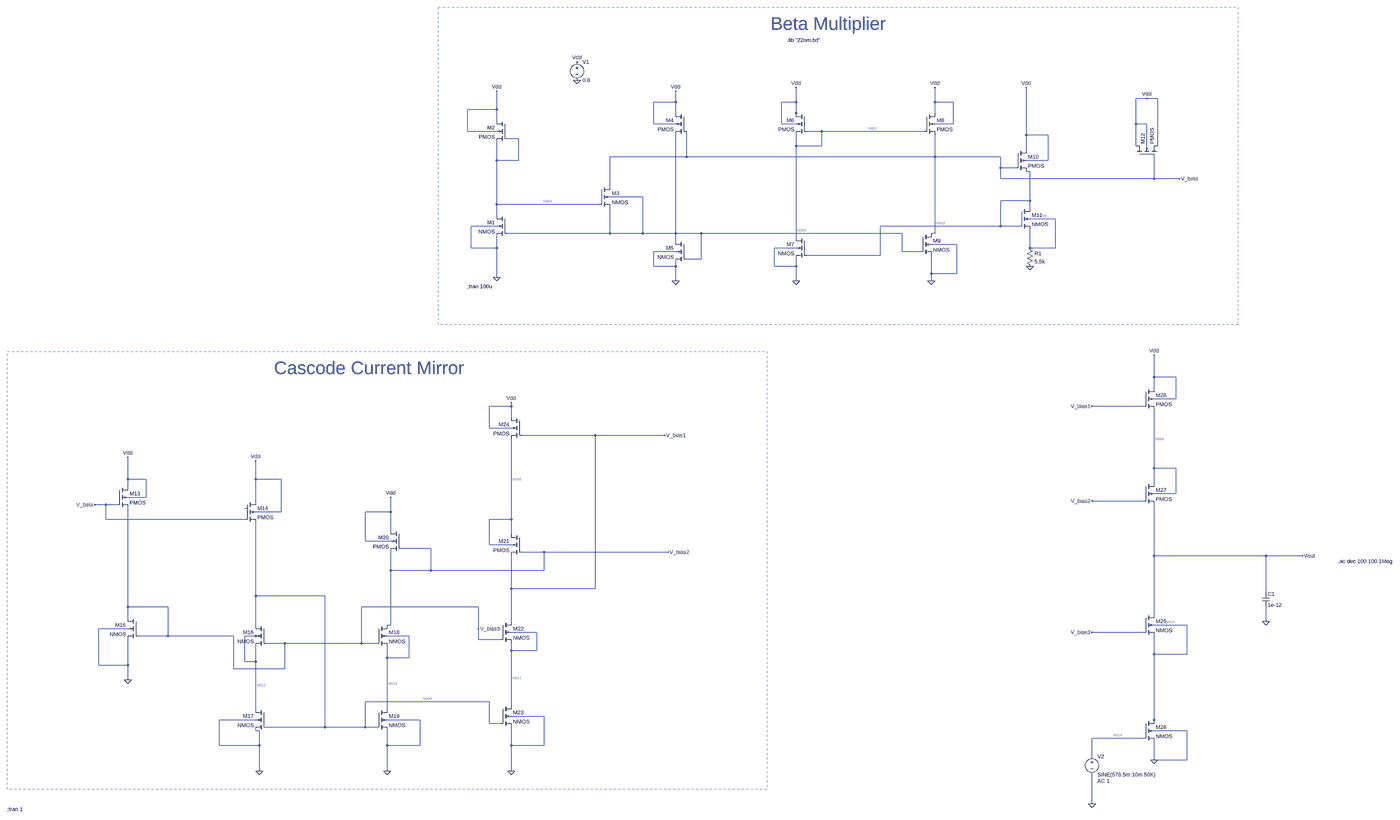
[diagram p0: schematic Vivek_22nm.asc, whole sheet]
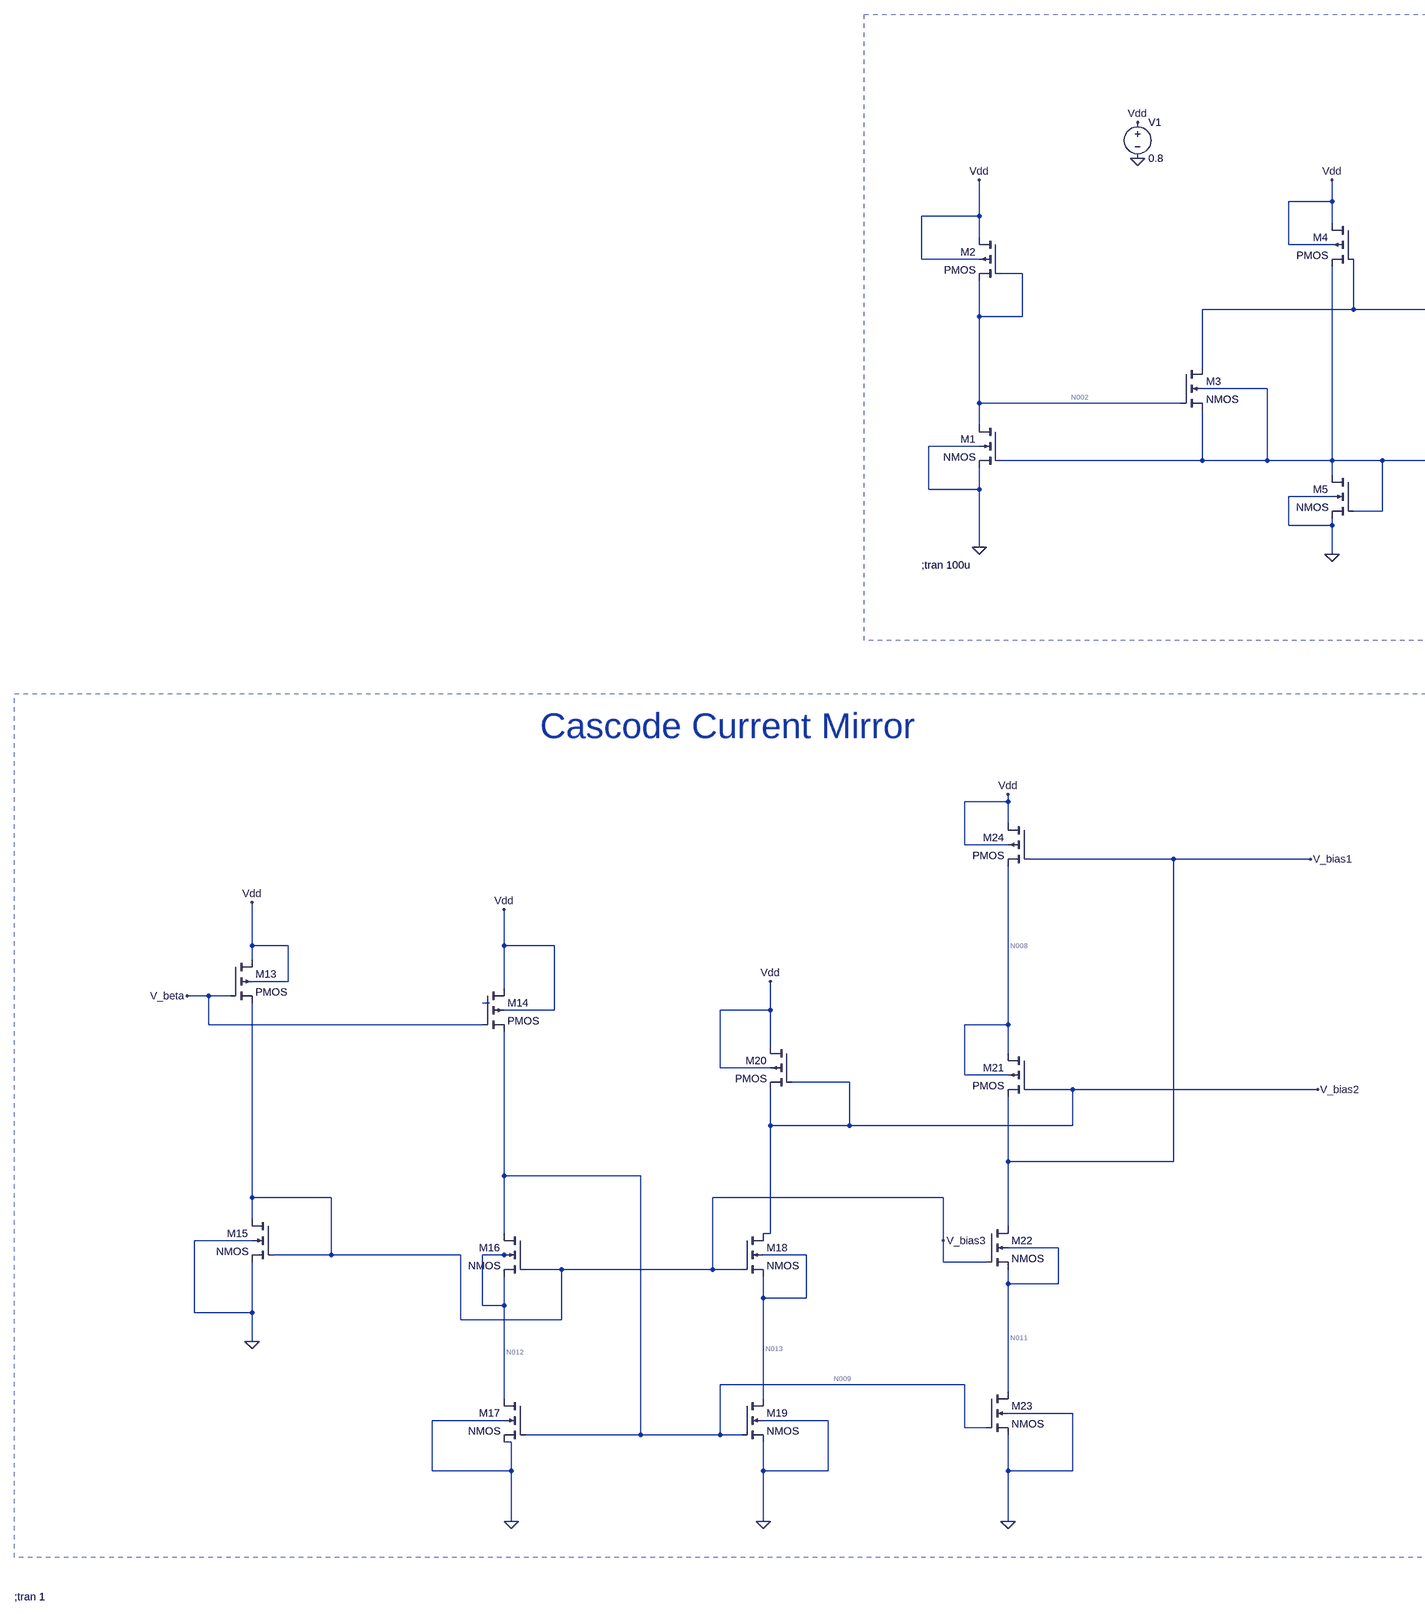
[diagram p1: schematic Vivek_22nm.asc, part, row 1 of 1, column 1 of 2]
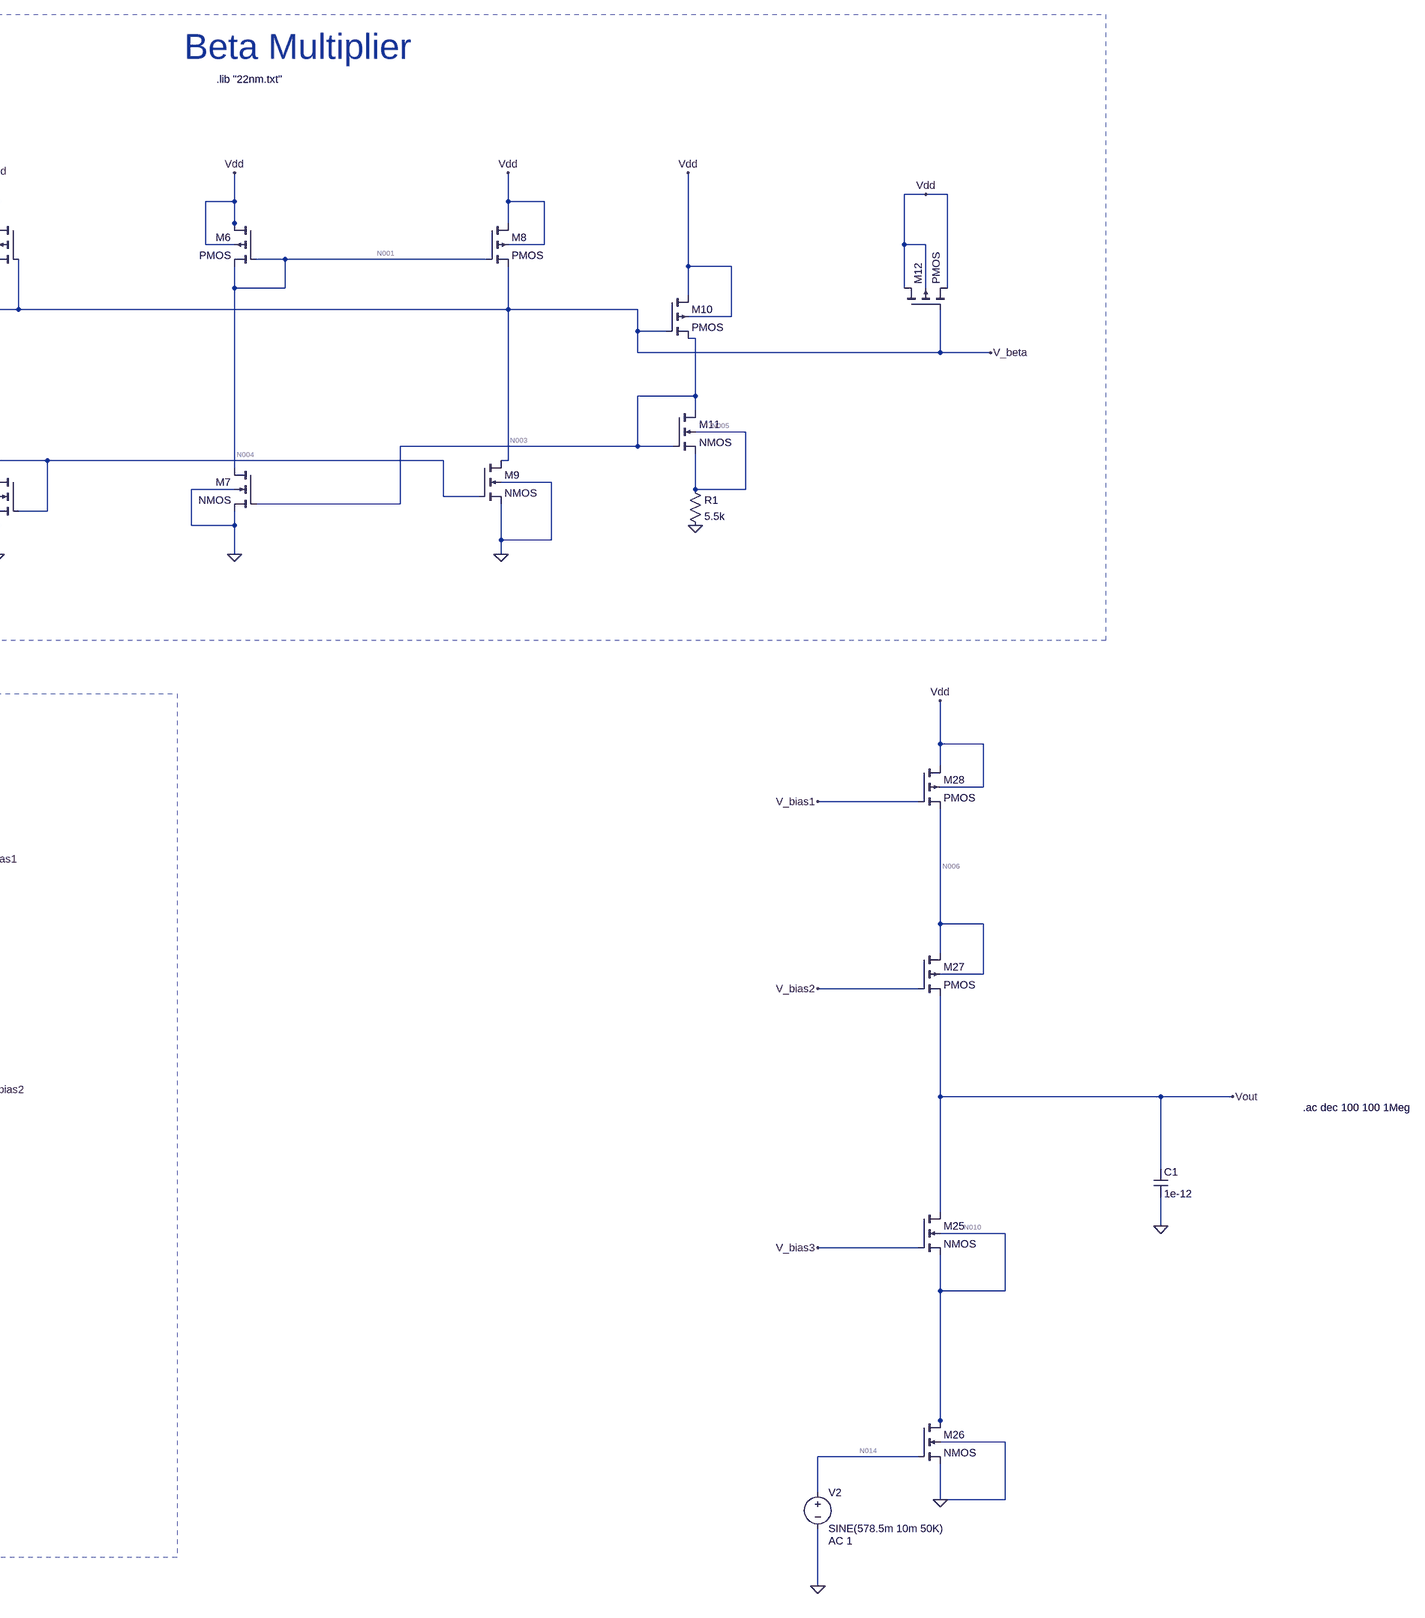
[diagram p2: schematic Vivek_22nm.asc, part, row 1 of 1, column 2 of 2]
Vivek_22nm.asc, the LTspice schematic file:
Version 4
SHEET 1 3448 2104
WIRE 1824 -1168 1776 -1168
WIRE 1872 -1168 1824 -1168
WIRE -240 -1152 -240 -1200
WIRE -240 -1152 -336 -1152
WIRE 288 -1152 288 -1216
WIRE 288 -1152 224 -1152
WIRE 896 -1152 896 -1216
WIRE 976 -1152 896 -1152
WIRE -1024 -1120 -1024 -1200
WIRE -1024 -1120 -1152 -1120
WIRE -240 -1104 -240 -1152
WIRE 288 -1104 288 -1152
WIRE 896 -1104 896 -1152
WIRE 288 -1088 288 -1104
WIRE -1024 -1072 -1024 -1120
WIRE -336 -1056 -336 -1152
WIRE -240 -1056 -336 -1056
WIRE 224 -1056 224 -1152
WIRE 288 -1056 224 -1056
WIRE 976 -1056 976 -1152
WIRE 976 -1056 896 -1056
WIRE 1776 -1056 1776 -1168
WIRE 1824 -1056 1776 -1056
WIRE -1152 -1024 -1152 -1120
WIRE -1024 -1024 -1152 -1024
WIRE 400 -1024 336 -1024
WIRE 848 -1024 400 -1024
WIRE 1296 -1008 1296 -1216
WIRE 1392 -1008 1296 -1008
WIRE -928 -992 -976 -992
WIRE 288 -960 288 -1008
WIRE 400 -960 400 -1024
WIRE 400 -960 288 -960
WIRE 1776 -960 1776 -1056
WIRE 1824 -960 1824 -1056
WIRE 1872 -960 1872 -1168
WIRE 1296 -944 1296 -1008
WIRE -192 -912 -192 -1024
WIRE -192 -912 -528 -912
WIRE 896 -912 896 -1008
WIRE 896 -912 -192 -912
WIRE 1184 -912 896 -912
WIRE -1024 -896 -1024 -976
WIRE -928 -896 -928 -992
WIRE -928 -896 -1024 -896
WIRE 1392 -896 1392 -1008
WIRE 1392 -896 1296 -896
WIRE 1184 -864 1184 -912
WIRE 1248 -864 1184 -864
WIRE 1312 -848 1296 -848
WIRE 1184 -816 1184 -864
WIRE 1856 -816 1856 -912
WIRE 1856 -816 1184 -816
WIRE 1968 -816 1856 -816
WIRE -528 -784 -528 -912
WIRE -384 -736 -528 -736
WIRE 1312 -720 1312 -848
WIRE 1312 -720 1184 -720
WIRE -1024 -704 -1024 -896
WIRE -576 -704 -1024 -704
WIRE 1312 -688 1312 -720
WIRE -1024 -656 -1024 -704
WIRE 1424 -640 1312 -640
WIRE -1024 -608 -1136 -608
WIRE 1184 -608 1184 -720
WIRE 1184 -608 656 -608
WIRE 1264 -608 1184 -608
WIRE -528 -576 -528 -688
WIRE -528 -576 -976 -576
WIRE -384 -576 -384 -736
WIRE -384 -576 -528 -576
WIRE -240 -576 -240 -1008
WIRE -240 -576 -384 -576
WIRE -128 -576 -240 -576
WIRE 752 -576 -128 -576
WIRE 896 -576 896 -912
WIRE 896 -576 880 -576
WIRE 288 -560 288 -960
WIRE -240 -544 -240 -576
WIRE 992 -528 880 -528
WIRE -1136 -512 -1136 -608
WIRE -1024 -512 -1024 -560
WIRE -1024 -512 -1136 -512
WIRE 288 -512 192 -512
WIRE 1312 -512 1312 -592
WIRE 1424 -512 1424 -640
WIRE 1424 -512 1312 -512
WIRE -240 -496 -336 -496
WIRE 752 -496 752 -576
WIRE 832 -496 752 -496
WIRE 656 -480 656 -608
WIRE 656 -480 336 -480
WIRE -128 -464 -128 -576
WIRE -128 -464 -192 -464
WIRE -336 -432 -336 -496
WIRE -240 -432 -240 -448
WIRE -240 -432 -336 -432
WIRE 192 -432 192 -512
WIRE 288 -432 288 -464
WIRE 288 -432 192 -432
WIRE 880 -400 880 -480
WIRE 992 -400 992 -528
WIRE 992 -400 880 -400
WIRE -1024 -384 -1024 -512
WIRE -240 -368 -240 -432
WIRE 288 -368 288 -432
WIRE 880 -368 880 -400
WIRE 1856 192 1856 96
WIRE 1952 192 1856 192
WIRE 1856 240 1856 192
WIRE 1952 288 1952 192
WIRE 1952 288 1856 288
WIRE -960 320 -960 304
WIRE -960 320 -1056 320
WIRE 1808 320 1584 320
WIRE -960 368 -960 320
WIRE -1056 416 -1056 320
WIRE -960 416 -1056 416
WIRE -592 448 -912 448
WIRE -288 448 -592 448
WIRE 1856 592 1856 336
WIRE 1952 592 1856 592
WIRE -2640 640 -2640 544
WIRE -2560 640 -2640 640
WIRE -2080 640 -2080 560
WIRE -1968 640 -2080 640
WIRE 1856 656 1856 592
WIRE -2640 672 -2640 640
WIRE 1952 704 1952 592
WIRE 1952 704 1856 704
WIRE -2560 720 -2560 640
WIRE -2560 720 -2640 720
WIRE -2080 736 -2080 640
WIRE 1808 736 1584 736
WIRE -2736 752 -2784 752
WIRE -2688 752 -2736 752
WIRE -2112 768 -2128 768
WIRE -1968 784 -1968 640
WIRE -1968 784 -2080 784
WIRE -1488 784 -1488 720
WIRE -1488 784 -1600 784
WIRE -2736 816 -2736 752
WIRE -2128 816 -2736 816
WIRE -960 816 -960 464
WIRE -960 816 -1056 816
WIRE -1488 864 -1488 784
WIRE -960 880 -960 816
WIRE -1600 912 -1600 784
WIRE -1488 912 -1600 912
WIRE -1056 928 -1056 816
WIRE -960 928 -1056 928
WIRE -1312 944 -1440 944
WIRE -816 960 -912 960
WIRE -272 960 -816 960
WIRE 1856 976 1856 752
WIRE 2576 976 1856 976
WIRE 2736 976 2576 976
WIRE -1488 1040 -1488 960
WIRE -1312 1040 -1312 944
WIRE -1312 1040 -1488 1040
WIRE -816 1040 -816 960
WIRE -816 1040 -1312 1040
WIRE -960 1120 -960 976
WIRE -592 1120 -592 448
WIRE -592 1120 -960 1120
WIRE 2576 1136 2576 976
WIRE -2080 1152 -2080 832
WIRE -1776 1152 -2080 1152
WIRE -2640 1200 -2640 768
WIRE -2464 1200 -2640 1200
WIRE -1104 1200 -1616 1200
WIRE 1856 1232 1856 976
WIRE -2640 1248 -2640 1200
WIRE -960 1264 -960 1120
WIRE 2576 1264 2576 1200
WIRE -2080 1280 -2080 1152
WIRE -1488 1280 -1488 1040
WIRE -1488 1280 -1504 1280
WIRE 2000 1280 1856 1280
WIRE -2640 1296 -2768 1296
WIRE -1104 1296 -1104 1200
WIRE -848 1312 -960 1312
WIRE 1808 1312 1584 1312
WIRE -2464 1328 -2464 1200
WIRE -2464 1328 -2592 1328
WIRE -2176 1328 -2464 1328
WIRE -2080 1328 -2128 1328
WIRE -2064 1328 -2080 1328
WIRE -1408 1328 -1504 1328
WIRE -1104 1344 -1104 1296
WIRE -1008 1344 -1104 1344
WIRE -1952 1360 -2032 1360
WIRE -1616 1360 -1616 1200
WIRE -1616 1360 -1952 1360
WIRE -1552 1360 -1616 1360
WIRE -960 1392 -960 1360
WIRE -848 1392 -848 1312
WIRE -848 1392 -960 1392
WIRE 1856 1408 1856 1328
WIRE 2000 1408 2000 1280
WIRE 2000 1408 1856 1408
WIRE -1504 1424 -1504 1376
WIRE -1408 1424 -1408 1328
WIRE -1408 1424 -1504 1424
WIRE -2128 1440 -2128 1328
WIRE -2080 1440 -2080 1376
WIRE -2080 1440 -2128 1440
WIRE -2768 1456 -2768 1296
WIRE -2640 1456 -2640 1344
WIRE -2640 1456 -2768 1456
WIRE -2176 1472 -2176 1328
WIRE -1952 1472 -1952 1360
WIRE -1952 1472 -2176 1472
WIRE -2640 1520 -2640 1456
WIRE -1056 1616 -1600 1616
WIRE -960 1632 -960 1392
WIRE -2080 1648 -2080 1440
WIRE -1504 1648 -1504 1424
WIRE -816 1680 -960 1680
WIRE -2080 1696 -2240 1696
WIRE -1360 1696 -1504 1696
WIRE 1856 1696 1856 1408
WIRE -1056 1712 -1056 1616
WIRE -1008 1712 -1056 1712
WIRE 1856 1712 1856 1696
WIRE -1776 1728 -1776 1152
WIRE -1776 1728 -2032 1728
WIRE -1600 1728 -1600 1616
WIRE -1600 1728 -1776 1728
WIRE -1552 1728 -1600 1728
WIRE -2064 1744 -2080 1744
WIRE 2000 1744 1856 1744
WIRE 1808 1776 1584 1776
WIRE -2240 1808 -2240 1696
WIRE -2064 1808 -2064 1744
WIRE -2064 1808 -2240 1808
WIRE -1504 1808 -1504 1744
WIRE -1360 1808 -1360 1696
WIRE -1360 1808 -1504 1808
WIRE -960 1808 -960 1728
WIRE -816 1808 -816 1680
WIRE -816 1808 -960 1808
WIRE 1584 1856 1584 1776
WIRE 1856 1872 1856 1792
WIRE 2000 1872 2000 1744
WIRE 2000 1872 1856 1872
WIRE -2064 1920 -2064 1808
WIRE -1504 1920 -1504 1808
WIRE -960 1920 -960 1808
WIRE 1584 2064 1584 1936
FLAG 288 -368 0
FLAG 880 -368 0
FLAG 1312 -432 0
FLAG -240 -368 0
FLAG -1024 -384 0
FLAG -240 -1200 Vdd
FLAG 288 -1216 Vdd
FLAG 896 -1216 Vdd
FLAG 1296 -1216 Vdd
FLAG 1824 -1168 Vdd
FLAG -1024 -1200 Vdd
FLAG -672 -1328 Vdd
FLAG -672 -1248 0
FLAG 1968 -816 V_beta
FLAG -2640 1520 0
FLAG -2064 1920 0
FLAG -1504 1920 0
FLAG -960 1920 0
FLAG -2640 544 Vdd
FLAG -2080 560 Vdd
FLAG -1488 720 Vdd
FLAG -960 304 Vdd
FLAG -2784 752 V_beta
FLAG -288 448 V_bias1
FLAG -272 960 V_bias2
FLAG 1584 320 V_bias1
FLAG 1584 736 V_bias2
FLAG 1584 1312 V_bias3
FLAG 1856 1872 0
FLAG 2576 1264 0
FLAG 1856 96 Vdd
FLAG 1584 2064 0
FLAG 2736 976 Vout
FLAG -1104 1296 V_bias3
SYMBOL nmos4 -976 -656 M0
SYMATTR InstName M1
SYMATTR Value2 l=44n w=220n
SYMBOL pmos4 -976 -1072 M0
SYMATTR InstName M2
SYMATTR Value2 l=440n w=220n
SYMBOL nmos4 -576 -784 R0
SYMATTR InstName M3
SYMATTR Value2 l=44n w=88n
SYMBOL pmos4 -192 -1104 M0
SYMATTR InstName M4
SYMATTR Value2 l=44n w=528n
SYMBOL nmos4 -192 -544 M0
SYMATTR InstName M5
SYMATTR Value2 l=44n w=220n
SYMBOL pmos4 336 -1104 M0
SYMATTR InstName M6
SYMATTR Value2 l=44n w=528n
SYMBOL nmos4 336 -560 M0
SYMATTR InstName M7
SYMATTR Value2 l=44n w=220n
SYMBOL pmos4 848 -1104 R0
SYMATTR InstName M8
SYMATTR Value2 l=44n w=528n
SYMBOL nmos4 832 -576 R0
SYMATTR InstName M9
SYMATTR Value2 l=44n w=220n
SYMBOL pmos4 1248 -944 R0
SYMATTR InstName M10
SYMATTR Value2 l=44n w=528n
SYMBOL nmos4 1264 -688 R0
SYMATTR InstName M11
SYMATTR Value2 l=44n w=660n
SYMBOL res 1296 -528 R0
SYMATTR InstName R1
SYMATTR Value 5.5k
SYMBOL pmos4 1776 -912 R270
SYMATTR InstName M12
SYMATTR Value2 l=1100n w=1100n
SYMBOL voltage -672 -1344 R0
WINDOW 123 0 0 Left 0
WINDOW 39 0 0 Left 0
SYMATTR InstName V1
SYMATTR Value 0.8
SYMBOL pmos4 -2688 672 R0
SYMATTR InstName M13
SYMATTR Value2 l=44n w=528n
SYMBOL pmos4 -2128 736 R0
SYMATTR InstName M14
SYMATTR Value2 l=44n w=528n
SYMBOL nmos4 -2592 1248 M0
SYMATTR InstName M15
SYMATTR Value2 l=44n w=110n
SYMBOL nmos4 -2032 1280 M0
SYMATTR InstName M16
SYMATTR Value2 l=44n w=220n
SYMBOL nmos4 -2032 1648 M0
SYMATTR InstName M17
SYMATTR Value2 l=44n w=220n
SYMBOL nmos4 -1552 1280 R0
SYMATTR InstName M18
SYMATTR Value2 l=44n w=220n
SYMBOL nmos4 -1552 1648 R0
SYMATTR InstName M19
SYMATTR Value2 l=44n w=220n
SYMBOL pmos4 -1440 864 M0
SYMATTR InstName M20
SYMATTR Value2 l=110n w=440n
SYMBOL pmos4 -912 880 M0
SYMATTR InstName M21
SYMATTR Value2 l=44n w=528n
SYMBOL nmos4 -1008 1264 R0
SYMATTR InstName M22
SYMATTR Value2 l=44n w=220n
SYMBOL nmos4 -1008 1632 R0
SYMATTR InstName M23
SYMATTR Value2 l=44n w=220n
SYMBOL pmos4 -912 368 M0
SYMATTR InstName M24
SYMATTR Value2 l=44n w=528n
SYMBOL nmos4 1808 1232 R0
SYMATTR InstName M25
SYMATTR Value2 l=44n w=242n
SYMBOL nmos4 1808 1696 R0
SYMATTR InstName M26
SYMATTR Value2 l=44n w=242n
SYMBOL pmos4 1808 656 R0
SYMATTR InstName M27
SYMATTR Value2 l=44n w=550n
SYMBOL pmos4 1808 240 R0
SYMATTR InstName M28
SYMATTR Value2 l=44n w=550n
SYMBOL cap 2560 1136 R0
SYMATTR InstName C1
SYMATTR Value 1e-12
SYMBOL voltage 1584 1840 R0
WINDOW 123 24 124 Left 2
WINDOW 39 0 0 Left 0
SYMATTR Value2 AC 1
SYMATTR InstName V2
SYMATTR Value SINE(578.5m 10m 50K)
TEXT -1152 -344 Left 2 !;tran 100u
TEXT 248 -1424 Left 2 !.lib "22nm.txt"
TEXT 176 -1496 Left 6 ;Beta Multiplier
TEXT -2000 152 Left 6 ;Cascode Current Mirror
TEXT -3168 2088 Left 2 !;tran 1
TEXT 3192 1000 Left 2 !.ac dec 100 100 1Meg
RECTANGLE Normal 2224 -176 -1280 -1568 2
RECTANGLE Normal 160 2000 -3168 80 2

The netlist it stands for:
* Vivek_22nm.asc
M1 N002 N004 0 0 NMOS l=44n w=220n
M2 Vdd N002 N002 Vdd PMOS l=440n w=220n
M3 V_beta N002 N004 N004 NMOS l=44n w=88n
M4 Vdd V_beta N004 Vdd PMOS l=44n w=528n
M5 N004 N004 0 0 NMOS l=44n w=220n
M6 Vdd N001 N001 Vdd PMOS l=44n w=528n
M7 N001 N003 0 0 NMOS l=44n w=220n
M8 Vdd N001 V_beta Vdd PMOS l=44n w=528n
M9 V_beta N004 0 0 NMOS l=44n w=220n
M10 Vdd V_beta N003 Vdd PMOS l=44n w=528n
M11 N003 N003 N005 N005 NMOS l=44n w=660n
R1 N005 0 5.5k
M12 Vdd V_beta Vdd Vdd PMOS l=1100n w=1100n
V1 Vdd 0 0.8
M13 Vdd V_beta V_bias3 Vdd PMOS l=44n w=528n
M14 Vdd V_beta N009 Vdd PMOS l=44n w=528n
M15 V_bias3 V_bias3 0 0 NMOS l=44n w=110n
M16 N009 V_bias3 N012 N012 NMOS l=44n w=220n
M17 N012 N009 0 0 NMOS l=44n w=220n
M18 V_bias2 V_bias3 N013 N013 NMOS l=44n w=220n
M19 N013 N009 0 0 NMOS l=44n w=220n
M20 Vdd V_bias2 V_bias2 Vdd PMOS l=110n w=440n
M21 N008 V_bias2 V_bias1 N008 PMOS l=44n w=528n
M22 V_bias1 V_bias3 N011 N011 NMOS l=44n w=220n
M23 N011 N009 0 0 NMOS l=44n w=220n
M24 Vdd V_bias1 N008 Vdd PMOS l=44n w=528n
M25 Vout V_bias3 N010 N010 NMOS l=44n w=242n
M26 N010 N014 0 0 NMOS l=44n w=242n
M27 N006 V_bias2 Vout N006 PMOS l=44n w=550n
M28 Vdd V_bias1 N006 Vdd PMOS l=44n w=550n
C1 Vout 0 1e-12
V2 N014 0 SINE(578.5m 10m 50K) AC 1
.model NMOS NMOS
.model PMOS PMOS
.lib standard.mos
;tran 100u
.lib "22nm.txt"
* Beta Multiplier
* Cascode Current Mirror
;tran 1
.ac dec 100 100 1Meg
.backanno
.end

* Results of the author's LTspice run, read from the files saved beside the schematic
* Operating Point, zero values left out:
*   V(n002) = 12.38 mV
*   V(n004) = 556.6 mV
*   V(vdd) = 800 mV
*   V(v_beta) = 228.9 mV
*   V(n001) = 249.3 mV
*   V(n003) = 555.3 mV
*   V(n005) = 67.44 mV
*   V(v_bias3) = 612.8 mV
*   V(n009) = 605.1 mV
*   V(n012) = 58.4 mV
*   V(v_bias2) = 118.1 mV
*   V(n013) = 44.68 mV
*   V(n008) = 673.7 mV
*   V(v_bias1) = 225.4 mV
*   V(n011) = 53.09 mV
*   V(vout) = 488.9 mV
*   V(n010) = 66.22 mV
*   V(n014) = 578.5 mV
*   V(n006) = 681.6 mV
*   Id(M1) = 2.067 µA
*   Ig(M1) = 23.11 pA
*   Is(M1) = -2.067 µA
*   Id(M3) = -3.178 nA
*   Ig(M3) = -7.111 pA
*   Ib(M3) = 3.178 nA
*   Is(M3) = 7.352 pA
*   Id(M5) = 12.25 µA
*   Ig(M5) = 17.82 pA
*   Is(M5) = -12.25 µA
*   Id(M7) = 10.79 µA
*   Ig(M7) = 18.08 pA
*   Is(M7) = -10.79 µA
*   Id(M9) = 10.89 µA
*   Ig(M9) = 18.6 pA
*   Is(M9) = -10.89 µA
*   Id(M11) = 12.26 µA
*   Ig(M11) = 16.72 pA
*   Is(M11) = -12.26 µA
*   Id(M15) = 11.77 µA
*   Ig(M15) = 17.42 pA
*   Is(M15) = -11.77 µA
*   Id(M16) = 11.85 µA
*   Ig(M16) = 17.26 pA
*   Is(M16) = -11.85 µA
*   Id(M17) = 11.85 µA
*   Ig(M17) = 39.18 pA
*   Is(M17) = -11.85 µA
*   Id(M18) = 9.645 µA
*   Ig(M18) = 24.76 pA
*   Is(M18) = -9.645 µA
*   Id(M19) = 9.645 µA
*   Ig(M19) = 39.78 pA
*   Is(M19) = -9.645 µA
*   Id(M22) = 11.04 µA
*   Ig(M22) = 20.14 pA
*   Is(M22) = -11.04 µA
*   Id(M23) = 11.04 µA
*   Ig(M23) = 39.41 pA
*   Is(M23) = -11.04 µA
*   Id(M25) = 11.21 µA
*   Ig(M25) = 16.9 pA
*   Is(M25) = -11.21 µA
*   Id(M26) = 11.21 µA
*   Ig(M26) = 31.49 pA
*   Is(M26) = -11.21 µA
*   Id(M2) = 2.067 µA
*   Ig(M2) = -60.69 pA
*   Ib(M2) = 61.4 pA
*   Is(M2) = -2.067 µA
*   Id(M4) = 12.25 µA
*   Is(M4) = -12.25 µA
*   Id(M6) = 10.79 µA
*   Is(M6) = -10.79 µA
*   Id(M8) = 10.88 µA
*   Is(M8) = -10.88 µA
*   Id(M10) = 12.26 µA
*   Is(M10) = -12.26 µA
*   Ig(M12) = -15.03 pA
*   Ib(M12) = 14.88 pA
*   Id(M13) = 11.77 µA
*   Is(M13) = -11.77 µA
*   Id(M14) = 11.85 µA
*   Is(M14) = -11.85 µA
*   Id(M20) = 9.645 µA
*   Ig(M20) = -4.03 pA
*   Ib(M20) = 4.701 pA
*   Is(M20) = -9.645 µA
*   Id(M21) = 11.04 µA
*   Is(M21) = -11.04 µA
*   Id(M24) = 11.04 µA
*   Is(M24) = -11.04 µA
*   Id(M27) = 11.21 µA
*   Is(M27) = -11.21 µA
*   Id(M28) = 11.21 µA
*   Is(M28) = -11.21 µA
*   I(R1) = 12.26 µA
*   I(V1) = -103.8 µA
*   I(V2) = -31.49 pA
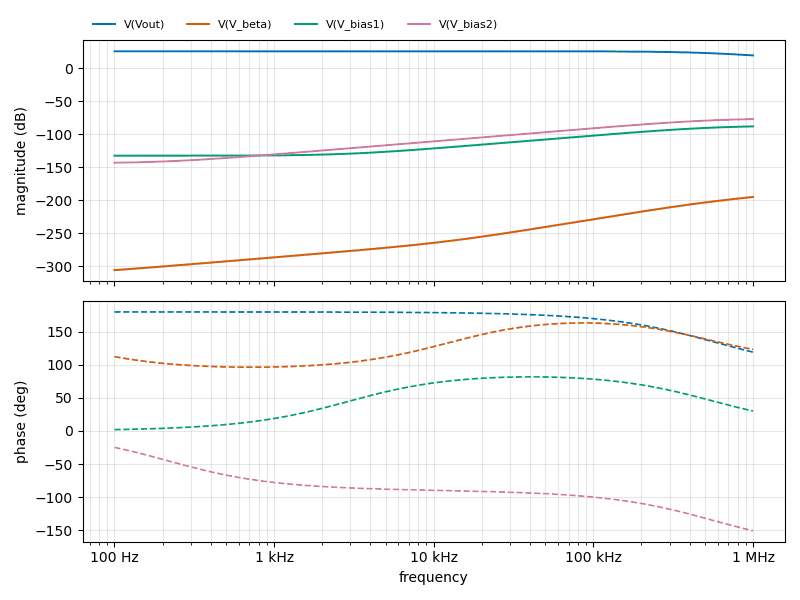
[diagram p3: AC Analysis of Vivek_22nm.asc, plotted from the saved traces]
* AC Analysis, 1 run:
*   V(Vout): 25.99 dB at 100 Hz, 19.74 dB at 1 MHz, peak 25.99 dB at 100 Hz, 3 dB below the peak at 557.7 kHz
*   V(V_beta): -306.06 dB at 100 Hz, -194.98 dB at 1 MHz, peak -194.98 dB at 1 MHz, 3 dB below the peak at 765.4 kHz
*   V(V_bias1): -132.41 dB at 100 Hz, -87.98 dB at 1 MHz, peak -87.98 dB at 1 MHz, 3 dB below the peak at 438 kHz
*   V(V_bias2): -143.09 dB at 100 Hz, -76.86 dB at 1 MHz, peak -76.86 dB at 1 MHz, 3 dB below the peak at 437.9 kHz